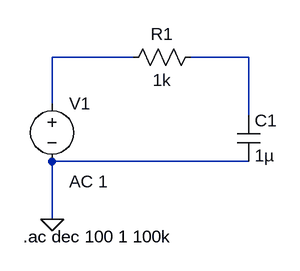
[diagram p0: schematic Lab1.1.asc]
Lab1.1.asc, the LTspice schematic file:
Version 4
SHEET 1 880 680
WIRE 192 48 80 48
WIRE 352 48 272 48
WIRE 80 112 80 48
WIRE 352 128 352 48
WIRE 352 192 80 192
WIRE 80 272 80 192
FLAG 80 272 0
SYMBOL voltage 80 96 R0
WINDOW 3 24 96 Invisible 2
WINDOW 123 24 124 Left 2
SYMATTR Value ""
SYMATTR Value2 AC 1
SYMATTR InstName V1
SYMBOL res 288 32 R90
WINDOW 0 0 56 VBottom 2
WINDOW 3 32 56 VTop 2
SYMATTR InstName R1
SYMATTR Value 1k
SYMBOL cap 336 128 R0
SYMATTR InstName C1
SYMATTR Value 1µ
TEXT 40 296 Left 2 !.ac dec 100 1 100k

The netlist it stands for:
* Lab1.1.asc
V1 N001 0 AC 1
R1 N002 N001 1k
C1 N002 0 1µ
.ac dec 100 1 100k
.backanno
.end